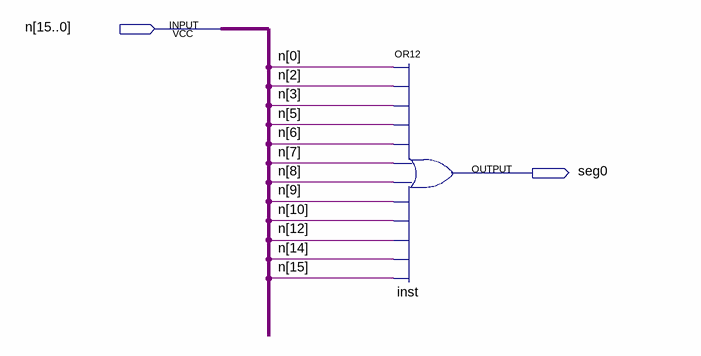
[diagram p0: schematic sheet]
// Quartus schematic seg0.bdf as structural Verilog: 1 symbols, 2 pins
module seg0 (
  input  [15:0] n,
  output seg0
);

  or inst (seg0, n[0], n[2], n[3], n[5], n[6], n[7], n[8], n[9], n[10], n[12], n[14], n[15]);
endmodule
